# EAGLE design monitoring_2 (EAGLE 9.6.2)
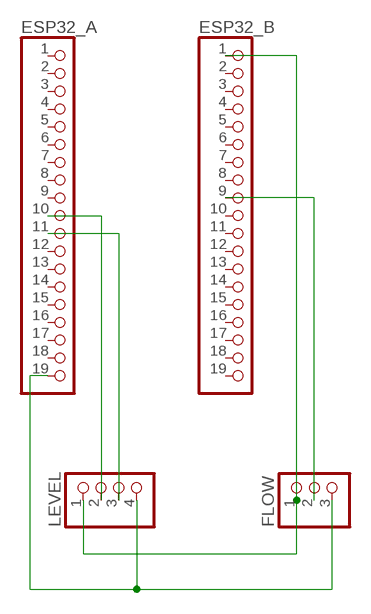
[diagram p0: schematic, sheet 1]

## Parts
ESP32_A  PINHD-1X19  [1X19]
ESP32_B  PINHD-1X19  [1X19]
FLOW  PINHD-1X3  [1X03]
LEVEL  PINHD-1X4  [1X04]

## Nets
N$1: ESP32_B.1 FLOW.1 LEVEL.1
N$2: ESP32_A.19 FLOW.3 LEVEL.4
N$3: ESP32_A.10 LEVEL.2
N$4: ESP32_A.11 LEVEL.3
N$5: ESP32_B.9 FLOW.2
Unconnected: ESP32_A.1 ESP32_A.2 ESP32_A.3 ESP32_A.4 ESP32_A.5 ESP32_A.6 ESP32_A.7 ESP32_A.8 ESP32_A.9 ESP32_A.12 ESP32_A.13 ESP32_A.14 ESP32_A.15 ESP32_A.16 ESP32_A.17 ESP32_A.18 ESP32_B.2 ESP32_B.3 ESP32_B.4 ESP32_B.5 ESP32_B.6 ESP32_B.7 ESP32_B.8 ESP32_B.10 ESP32_B.11 ESP32_B.12 ESP32_B.13 ESP32_B.14 ESP32_B.15 ESP32_B.16 ESP32_B.17 ESP32_B.18 ESP32_B.19

## Library data of the parts
ESP32_A ESP32_B = pinhead:PINHD-1X19: PIN HEADER
FLOW = pinhead:PINHD-1X3: PIN HEADER
LEVEL = pinhead:PINHD-1X4: PIN HEADER

## Board
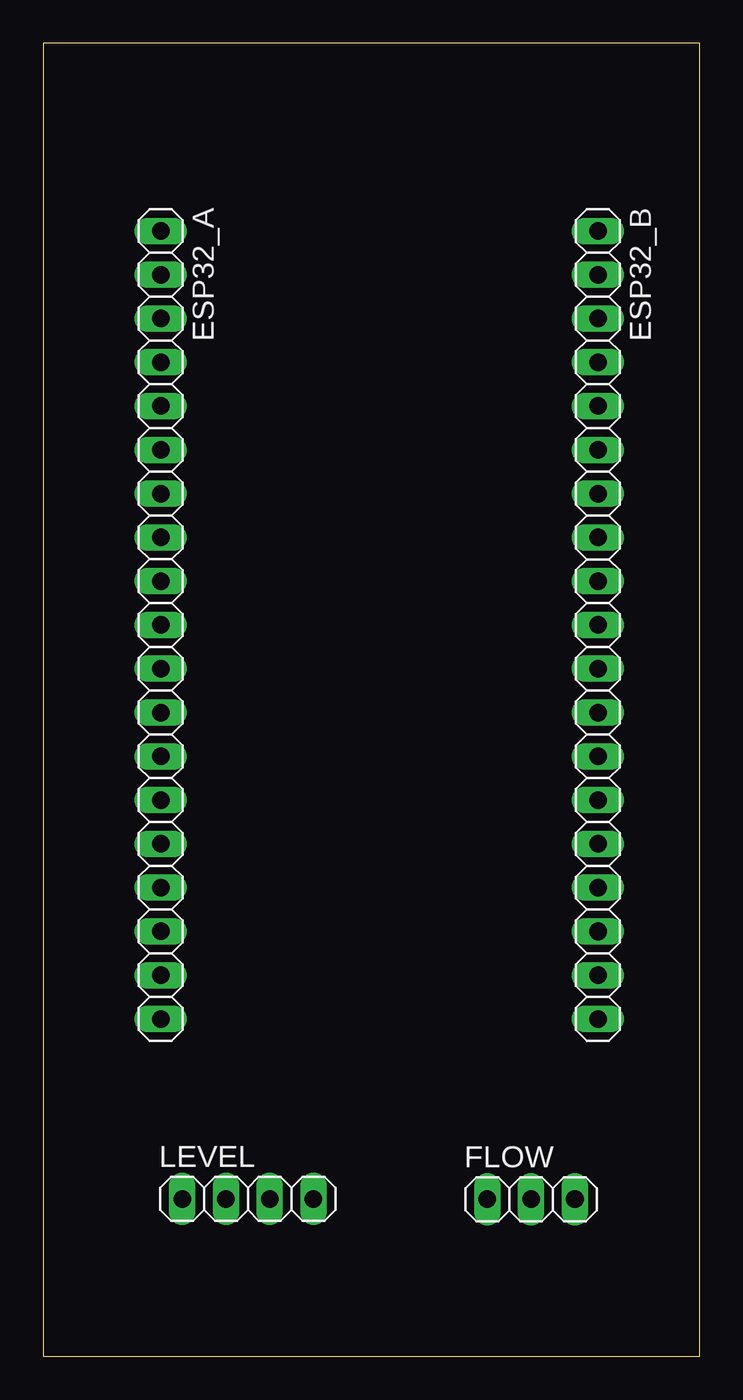
[diagram p1: board, top side]
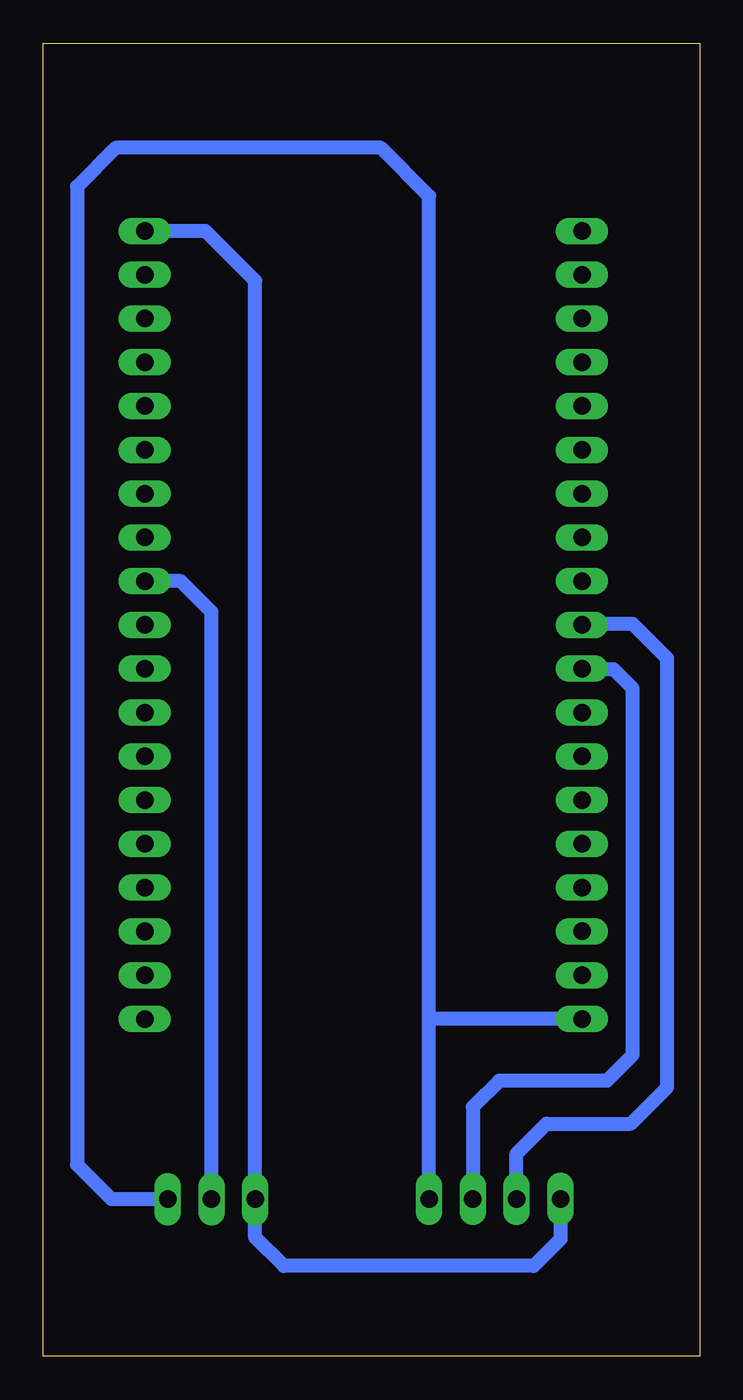
[diagram p2: board, bottom side, seen from below]

Size 38.1 x 76.2 mm. Coordinates in mm from the lower left corner, seen from the top.
Outline: 0,0 38.1,0 38.1,76.2 0,76.2 0,0
Copper layers (1*16): Top 0.035mm / dielectric 1.5mm / Bottom 0.035mm
Design rules "default": minimum track width 6mil, minimum drill 0.35mm, track to track 6mil, track to pad 6mil, pad to pad 6mil, via to via 6mil, smd to smd 6mil, copper to edge 40mil, drill to drill 6mil, minimum pad ring 10mil, minimum via ring 8mil, stop-mask expansion 4mil, vias tented up to drill 0mil, thermal gap 10mil

### Footprints (pad centres in the part's own frame; a part is rotated, then mirrored left to right if it is on the bottom)
1X19 = drill 1.016 long: 1 -22.86,0; 2 -20.32,0; 3 -17.78,0; 4 -15.24,0; 5 -12.7,0; 6 -10.16,0; 7 -7.62,0; 8 -5.08,0; 9 -2.54,0; 10 0,0; 11 2.54,0; 12 5.08,0; 13 7.62,0; 14 10.16,0; 15 12.7,0; 16 15.24,0; 17 17.78,0; 18 20.32,0; 19 22.86,0
1X03 = drill 1.016 long: 1 -2.54,0; 2 0,0; 3 2.54,0
1X04 = drill 1.016 long: 1 -3.81,0; 2 -1.27,0; 3 1.27,0; 4 3.81,0

### Placement (x,y rotation side)
ESP32_A  6.83,42.44 270 top
ESP32_B  32.2,42.44 270 top
FLOW  28.32,9.12 0 top
LEVEL  11.88,9.14 0 top

### Tracks (layer width: path | path; a pad name or v marks a point on that pad's centre or on a via)
N$1
  Bottom 0.813: ESP32_B.1 28.67,65.3 25.79,62.41 FLOW.1 25.79,6.91 24.12,5.25 9.62,5.25 8.07,6.8 LEVEL.1
N$2
  Bottom 0.813: LEVEL.4 15.7,19.62 | 15.7,19.62 15.7,67.32 18.5,70.12 33.88,70.12 36.12,67.88 36.12,11.12 34.12,9.12 FLOW.3 | ESP32_A.19 15.65,19.58 15.7,19.62
N$3
  Bottom 0.813: ESP32_A.10 6.77,42.5 3.88,42.5 1.88,40.5 1.88,15.62 4,13.5 8.88,13.5 10.62,11.76 LEVEL.2
N$4
  Bottom 0.813: LEVEL.3 13.15,14.47 11.62,16 5.38,16 3.88,17.5 3.88,38.75 5,39.88 6.8,39.88 ESP32_A.11
N$5
  Bottom 0.813: FLOW.2 28.32,43.2 30.1,44.98 ESP32_B.9